# Altium schematic sheet Generador De Retardo.SchDoc
size A4
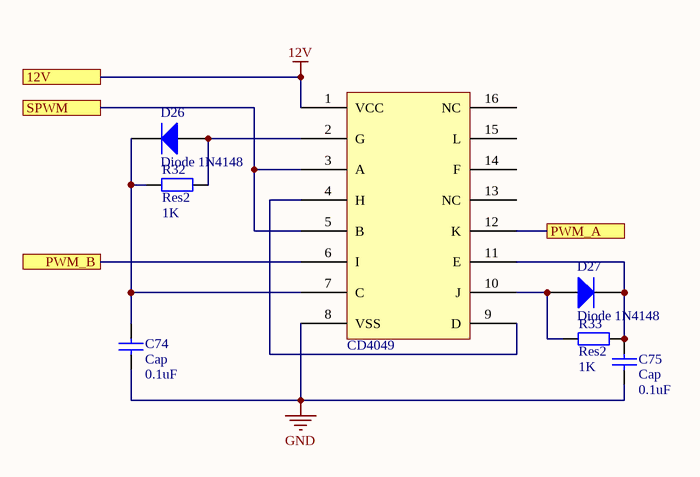
[diagram p0: Generador De Retardo.SchDoc]

## Parts
?  CD4049  [PDIP16]
C74  Cap  value 0.1uF  [RAD-0.3]
C75  Cap  value 0.1uF  [RAD-0.3]
D26  Diode 1N4148  [DO-35]
D27  Diode 1N4148  [DO-35]
R32  Res2  value 1K  [AXIAL-0.4]
R33  Res2  value 1K  [AXIAL-0.4]

## Ports
12V, PWM_A, PWM_B, SPWM

## Nets
12V: ?.1(VCC) ; port 12V
GND: ?.8(VSS) C74.1 C75.1
PWM_A: ?.12(K) ; port PWM_A
PWM_B: ?.6(I) ; port PWM_B
SPWM: ?.3(A) ?.5(B) ; port SPWM
Net?_2: ?.2(G) D26.1(A) R32.2
Net?_4: ?.4(H) ?.9(D)
Net?_7: ?.7(C) C74.2 D26.2(K) R32.1
Net?_10: ?.10(J) D27.1(A) R33.1
Net?_11: ?.11(E) C75.2 D27.2(K) R33.2

Not connected (* = marked no-connect by the designer): ? 13(NC) 14(F) 15(L) 16(NC)

## Library data of the parts
C74 C75 = Cap: Capacitor; Published: 8-Jun-2000; LatestRevisionDate: 17-Jul-2002; LatestRevisionNote: Re-released for DXP Platform.; PackageReference: RAD-0.3; Publisher: Altium Limited; PackageDescription: Radial Cap, Thru-Hole; 2 Leads; 0.3 in Pin Spacing
D26 D27 = Diode 1N4148: High Conductance Fast Diode; Published: 8-Jun-2000; LatestRevisionDate: 17-Jul-2002; LatestRevisionNote: Re-released for DXP Platform.; DatasheetVersion: 1997; PackageReference: DO-35; Publisher: Altium Limited; PackageDescription: Diode, Axial; Body 3.8 x 1.9 mm (LxDia. max), Lead Dia. 0.53 mm (max); Code_JEDEC: DO-204-AH; ComponentLink1Description: Manufacturer Link; ComponentLink1URL: http://www.fairchildsemi.com/; ComponentLink2Description: Datasheet; ComponentLink2URL: http://www.fairchildsemi.com/ds/1N%2F1N4148.pdf
R32 R33 = Res2: Resistor; Published: 8-Jun-2000; LatestRevisionDate: 17-Jul-2002; LatestRevisionNote: Re-released for DXP Platform.; PackageReference: AXIAL-0.4; Publisher: Altium Limited; PackageDescription: Axial Device, Thru-Hole; 2 Leads; 0.4 in Pin Spacing